# Altium schematic sheet 08_ADC_measure.SchDoc
size A; SheetNumber: 8; SheetTotal: 8
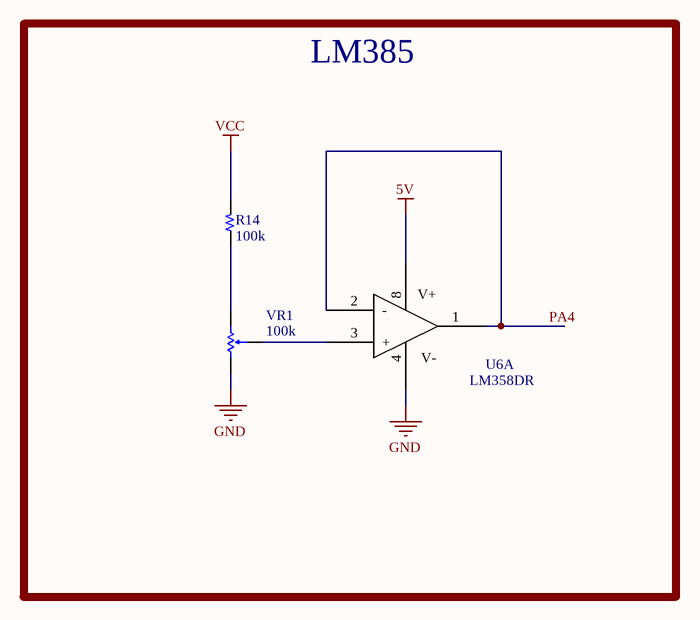
[diagram p0: 08_ADC_measure.SchDoc]

## Parts
R14  100k  [R 0805]
U6  LM358DR  [LM358DR]  (part A of 2)
VR1  100k  [R VAR E]

## Blocks framed on the sheet
LM385: R14 U6 VR1

## Nets
5V: U6.8(VCC)
GND: U6.4(GND) VR1.3
VCC: R14.2
PA4: U6.1(OUT_1) U6.2(-)
NetR14_1: R14.1 VR1.1
NetU6_3: U6.3(+) VR1.2

## Notes on the sheet
- (in symbol LM358DR, part A) V+; V-

## Library data of the parts
R14 = Resistor
U6 = LM358DR: Operational Amplifiers - Op Amps Dual Op Amp; Manufacturer: Texas Instruments; Active Read Current - Max: Active; CMRR - Common Mode Rejection Ratio: 80 dB; Dual Supply Voltage: +/- 3 V, +/- 5 V, +/- 9 V; GBP - Gain Bandwidth Product: 700 kHz; Ib - Input Bias Current: 250 nA; Number of Channels: 2 Channel; Operating Supply Current: 350 uA; Output Current per Channel: 20 mA; SR - Slew Rate: 300 mV/us; Supply Voltage - Max: 32 V; Supply Voltage - Min: 3 V; Voltage Gain dB: 100 dB; Vos - Input Offset Voltage: 7 mV; Supplier 1 URL: https://www.mouser.com/ProductDetail/Texas-Instruments/LM358DR?qs=Zu35EjizYSSY6pJ37yjmHA%3D%3D; Supplier 2 URL: N/A; Supplier 3 URL: N/A; Value: LM358DR; Manufacturer Part Number: LM358DR; Supplier 1: Mouser; Supplier 1 Part Number: 595-LM358DR; Supplier 2: Digi-Key; Supplier 2 Part Number: N/A; Supplier 3: thegioiic; Supplier 3 Part Number: N/A; Mount: SMD/SMT; Operating Temperature Max: + 85 C; Operating Temperature Min: - 40 C; Package / Case: SOIC-8; Packaging: Tape and Reel; ComponentLink1Description: Datasheet; ComponentLink1URL: https://www.ti.com/general/docs/suppproductinfo.tsp?distId=26&gotoUrl=https://www.ti.com/lit/gpn/lm358; LCSC Part #: C5423
VR1 = Resistor Variable